# Altium project SensoMonitor.PrjPcb
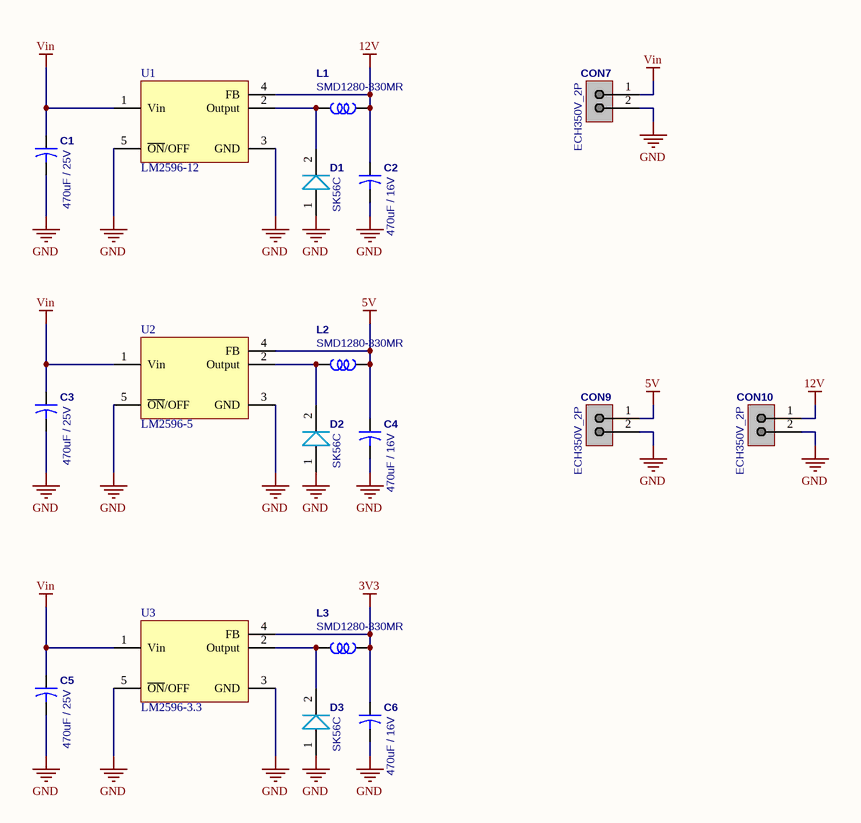
[diagram p0: Power.SchDoc]
4 sheets, 121 parts. Net scope: global (net labels, ports and power ports of the same name join across sheets).
Board file: SensoMonitor.PcbDoc
Sheets:
  Power.SchDoc
  MCU.SchDoc
  ETHERNET.SchDoc
  GPIO_COMM.SchDoc

## Sheet Power.SchDoc
size A4; SheetNumber: 1; SheetTotal: 4

### Parts
C1  470uF / 25V  [Cap470u_25V]
C2  470uF / 16V  [Cap470u_16V]
C3  470uF / 25V  [Cap470u_25V]
C4  470uF / 16V  [Cap470u_16V]
C5  470uF / 25V  [Cap470u_25V]
C6  470uF / 16V  [Cap470u_16V]
CON7  ECH350V_2P  [CON2P_ECH350V]
CON9  ECH350V_2P  [CON2P_ECH350V]
CON10  ECH350V_2P  [CON2P_ECH350V]
D1  SK56C  [DIODE_SK56C]
D2  SK56C  [DIODE_SK56C]
D3  SK56C  [DIODE_SK56C]
L1  SMD1280-330MR  [IND33uCoil]
L2  SMD1280-330MR  [IND33uCoil]
L3  SMD1280-330MR  [IND33uCoil]
U1  LM2596-12  [LM2596SX]
U2  LM2596-5  [LM2596SX]
U3  LM2596-3.3  [LM2596SX]

### Nets
3V3: C6.1 L3.1 U3.4(FB)
5V: C4.1 CON9.1 L2.1 U2.4(FB)
12V: C2.1 CON10.1 L1.1 U1.4(FB)
GND: C1.2 C2.2 C3.2 C4.2 C5.2 C6.2 CON7.2 CON9.2 CON10.2 D1.1 D2.1 D3.1 U1.3(GND) U1.5(~{ON}/OFF) U2.3(GND) U2.5(~{ON}/OFF) U3.3(GND) U3.5(~{ON}/OFF)
Vin: C1.1 C3.1 C5.1 CON7.1 U1.1(Vin) U2.1(Vin) U3.1(Vin)
NetD1_2: D1.2 L1.2 U1.2(Output)
NetD2_2: D2.2 L2.2 U2.2(Output)
NetD3_2: D3.2 L3.2 U3.2(Output)

### Library data of the parts
C1 C3 C5 = Cap470u_25V: Capacitor, 470uF / 25V / 10PI / SMD, 10mm; Value: 220uF/35V SMD_D8; Published: 23-Sep-2002; PackageReference: CAPR5-4X5; Publisher: Altium Limited
C2 C4 C6 = Cap470u_16V: Capacitor, 470uF / 25V / 8PI / SMD, 8mm; Value: 220uF/35V SMD_D8; Published: 23-Sep-2002; PackageReference: CAPR5-4X5; Publisher: Altium Limited
CON7 CON9 CON10 = CON2P_ECH350V: Connector, Terminal block 2p_ECH350V
D1-D3 = DIODE_SK56C: Schottky Barrier Rectifier SK56C
L1-L3 = IND33uCoil: 12.5mmX12.5mmX8.0mm smd Inductor, Hanam electornic.
U1 = LM2596-12: LM2596 SIMPLE SWITCHER® Power Converter 150-kHz  3-A Step-Down Voltage Regulator
U2 = LM2596-5: LM2596 SIMPLE SWITCHER® Power Converter 150-kHz  3-A Step-Down Voltage Regulator
U3 = LM2596-3.3: LM2596 SIMPLE SWITCHER® Power Converter 150-kHz  3-A Step-Down Voltage Regulator

## Sheet MCU.SchDoc
size A4; SheetNumber: 2; SheetTotal: 4
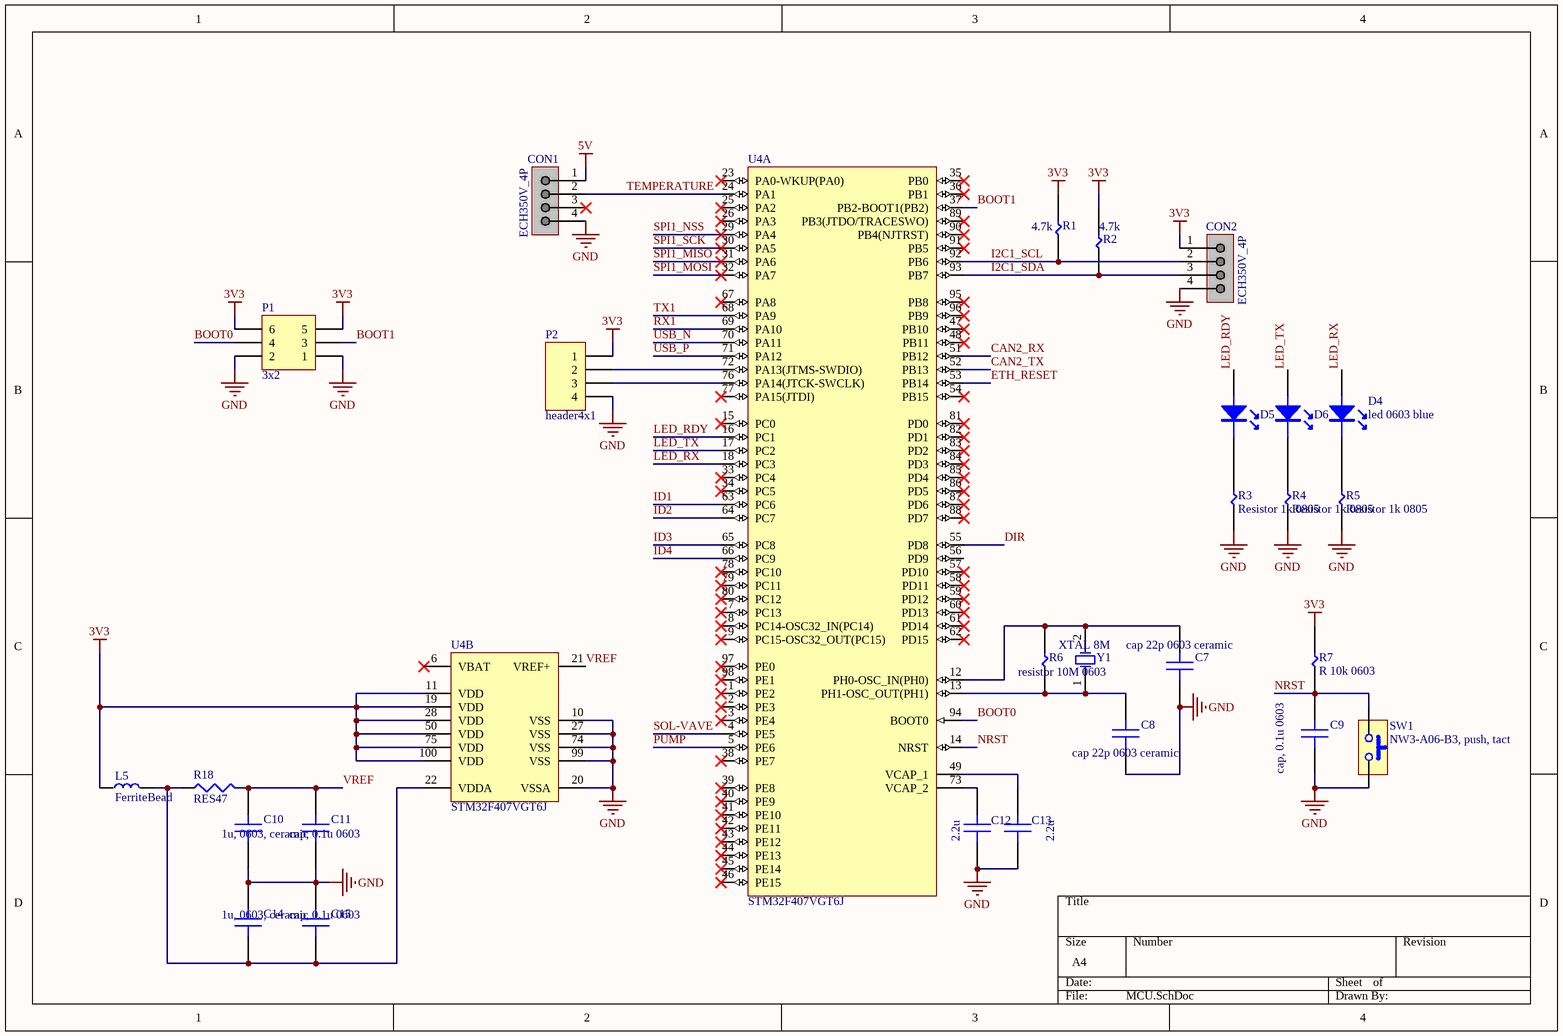
[diagram p1: MCU.SchDoc]

### Parts
C7  cap 22p 0603 ceramic  [CAP22p_0603_ceramic]
C8  cap 22p 0603 ceramic  [CAP22p_0603_ceramic]
C9  cap, 0.1u 0603  [CAP0.1u_0603_ceramic]
C10  1u, 0603, ceramic  [CAP1u_0603_ceramic]
C11  cap, 0.1u 0603  [CAP0.1u_0603_ceramic]
C12  2.2u  [CAP2.2u_0603]
C13  2.2u  [CAP2.2u_0603]
C14  1u, 0603, ceramic  [CAP1u_0603_ceramic]
C15  cap, 0.1u 0603  [CAP0.1u_0603_ceramic]
CON1  ECH350V_4P  [CON4P_ECH350V]
CON2  ECH350V_4P  [CON4P_ECH350V]
D4  led 0603 blue  [LED0603_BLUE]
D5  LED  [LED0603_GREEN]  (value not drawn)
D6  LED  [LED0603_GREEN]  (value not drawn)
L5  FerriteBead  [FerriteBD1608_102]
P1  3x2  [HDR3X2]
P2  header4x1  [HEADER4X1]
R1  4.7k  [RES4.7k_0603]
R2  4.7k  [RES4.7k_0603]
R3  Resistor 1k 0805  [RES1K_0805]
R4  Resistor 1k 0805  [RES1K_0805]
R5  Resistor 1k 0805  [RES1K_0805]
R6  resistor 10M 0603  [RES10M_0603]
R7  R 10k 0603  [RES10K_0603]
R18  RES47  [RES47_0603]
SW1  NW3-A06-B3, push, tact  [SW_TACT1]
U4  STM32F407VGT6J  [STM-LQFP100_L]  (parts A,B of 2)
Y1  XTAL 8M  [XTAL_SMD_8M]

### Nets
3V3: CON2.1 L5.1 P1.5 P1.6 P2.1 R1.2 R2.2 R7.2 U4.11(VDD) U4.19(VDD) U4.28(VDD) U4.50(VDD) U4.75(VDD) U4.100(VDD)
5V: CON1.1
GND: C7.1 C8.1 C9.1 C10.1 C11.1 C12.1 C13.1 C14.2 C15.2 CON1.4 CON2.4 P1.1 P1.2 P2.4 R3.1 R4.1 R5.1 SW1.2 U4.10(VSS) U4.20(VSSA) U4.27(VSS) U4.74(VSS) U4.99(VSS)
BOOT0: P1.4 U4.94(BOOT0)
BOOT1: P1.3 U4.37(PB2-BOOT1(PB2))
CAN2_RX: U4.51(PB12)
CAN2_TX: U4.52(PB13)
DIR: U4.55(PD8)
ETH_RESET: U4.53(PB14)
I2C1_SCL: CON2.2 R1.1 U4.92(PB6)
I2C1_SDA: CON2.3 R2.1 U4.93(PB7)
ID1: U4.63(PC6)
ID2: U4.64(PC7)
ID3: U4.65(PC8)
ID4: U4.66(PC9)
LED_RDY: D5.A U4.16(PC1)
LED_RX: D4.A U4.18(PC3)
LED_TX: D6.A U4.17(PC2)
NRST: C9.2 R7.1 SW1.1 U4.14(NRST)
PUMP: U4.5(PE6)
RX1: U4.69(PA10)
SOL-VAVE: U4.4(PE5)
SPI1_MISO: U4.31(PA6)
SPI1_MOSI: U4.32(PA7)
SPI1_NSS: U4.29(PA4)
SPI1_SCK: U4.30(PA5)
TEMPERATURE: CON1.2 U4.24(PA1)
TX1: U4.68(PA9)
USB_N: U4.70(PA11)
USB_P: U4.71(PA12)
VREF: C10.2 C11.2 R18.2 U4.21(VREF+)
NetC7_2: C7.2 R6.2 U4.12(PH0-OSC_IN(PH0)) Y1.2(OSC2)
NetC8_2: C8.2 R6.1 U4.13(PH1-OSC_OUT(PH1)) Y1.1(OSC1)
NetC12_2: C12.2 U4.73(VCAP_2)
NetC13_2: C13.2 U4.49(VCAP_1)
NetC14_1: C14.1 C15.1 L5.2 R18.1 U4.22(VDDA)
NetD4_K: D4.K R5.2
NetD5_K: D5.K R3.2
NetD6_K: D6.K R4.2
NetP2_2: P2.2 U4.72(PA13(JTMS-SWDIO))
NetP2_3: P2.3 U4.76(PA14(JTCK-SWCLK))

Not connected (* = marked no-connect by the designer): CON1 3(150)*; U4 1(PE2)* 2(PE3)* 3(PE4)* 6(VBAT)* 7(PC13)* 8(PC14-OSC32_IN(PC14))* 9(PC15-OSC32_OUT(PC15))* 15(PC0)* 23(PA0-WKUP(PA0))* 25(PA2)* 26(PA3)* 33(PC4)* 34(PC5)* 35(PB0)* 36(PB1)* 38(PE7)* 39(PE8)* 40(PE9)* 41(PE10)* 42(PE11)* 43(PE12)* 44(PE13)* 45(PE14)* 46(PE15)* 47(PB10)* 48(PB11)* 54(PB15)* 56(PD9) 57(PD10)* 58(PD11)* 59(PD12)* 60(PD13)* 61(PD14)* 62(PD15)* 67(PA8)* 77(PA15(JTDI))* 78(PC10)* 79(PC11)* 80(PC12)* 81(PD0)* 82(PD1)* 83(PD2)* 84(PD3)* 85(PD4)* 86(PD5)* 87(PD6)* 88(PD7)* 89(PB3(JTDO/TRACESWO))* 90(PB4(NJTRST))* 91(PB5)* 95(PB8)* 96(PB9)* 97(PE0)* 98(PE1)*

### Library data of the parts
C7 C8 = CAP22p_0603_ceramic
C9 C11 C15 = CAP0.1u_0603_ceramic
C10 C14 = CAP1u_0603_ceramic
C12 C13 = CAP2.2u_0603
CON1 CON2 = CON4P_ECH350V: Connector, Terminal block 4p_ECH350V
D4 = LED0603_BLUE
D5 D6 = LED0603_GREEN
L5 = FerriteBD1608_102: FCM1608KF-102T02, 200mA 1 700mΩ 1kΩ@100MHz ±25% 0603 Ferrite Beads ROHS; Manufacturer: Tai Tech; Supplier 1: Digikey; Manufacturer Part Number: FCM1608KF-102T02; RoHS: No; Category: Ferrite Beads and Chips; Stock 1: 15000; Pricing 1: 1=0.1, 10=0.025, 25=0.0224, 50=0.0202, 100=0.0182, 250=0.01332, 500=0.0097, 1000=0.00949 (USD); Supplier Part Number 1: 4816-FCM1608KF-102T02CT-ND
P1 = HEADER3X2: header 3x2
R1 R2 = RES4.7k_0603
R3-R5 = RES1K_0805
R6 = RES10M_0603
R7 = RES10K_0603
R18 = RES47_0603
SW1 = SW_TACT1: NW3-A06-B3
U4 = CMP-0243-00034-2: ARM Cortex-M4 32-bit MCU+FPU, 210 DMIPS, 1024 kB Flash, 192 kB Internal RAM, 82 I/Os, 100-pin LQFP, -40 to 85 degC, Tray; Manufacturer: STMicroelectronics; Internal RAM Size (kB): 192; Operating Frequency(F) (Processor speed) (MHz): 168; FLASH Size (Prog) (kB): 1024; I/Os (High Current): 82; Supply Voltage(Vcc) max (V): 3.6; D/A Converter: 2x12-bit; Supply Voltage(Vcc) min (V): 1.8; PackageReference: LQFP100; ComponentLink2URL: http://www.st.com/st-web-ui/static/active/en/resource/technical/document/datasheet/DM00037051.pdf; Packing: Tray; ComponentLink3Description: Package Specification; PackageDescription: 100-Pin Low Profile Quad Flat Package, 14 x 14 mm Body, 0.5 mm Pitch; PackageVersion: Rev. 1, 06/2013; ComponentLink1Description: Manufacturer URL; PartNumber: STM32F407VGT6J; Core: ARM Cortex-M4; ComponentLink2Description: Datasheet; ComponentLink1URL: http://www.st.com/web/en/home.html; Mounting Technology: Surface Mount; DatasheetVersion: Rev. 4; ComponentLink3URL: http://www.st.com/st-web-ui/static/active/en/resource/technical/document/data_brief/DM00071938.pdf
Y1 = XTAL8M

## Sheet ETHERNET.SchDoc
size A4; SheetNumber: 3; SheetTotal: 4
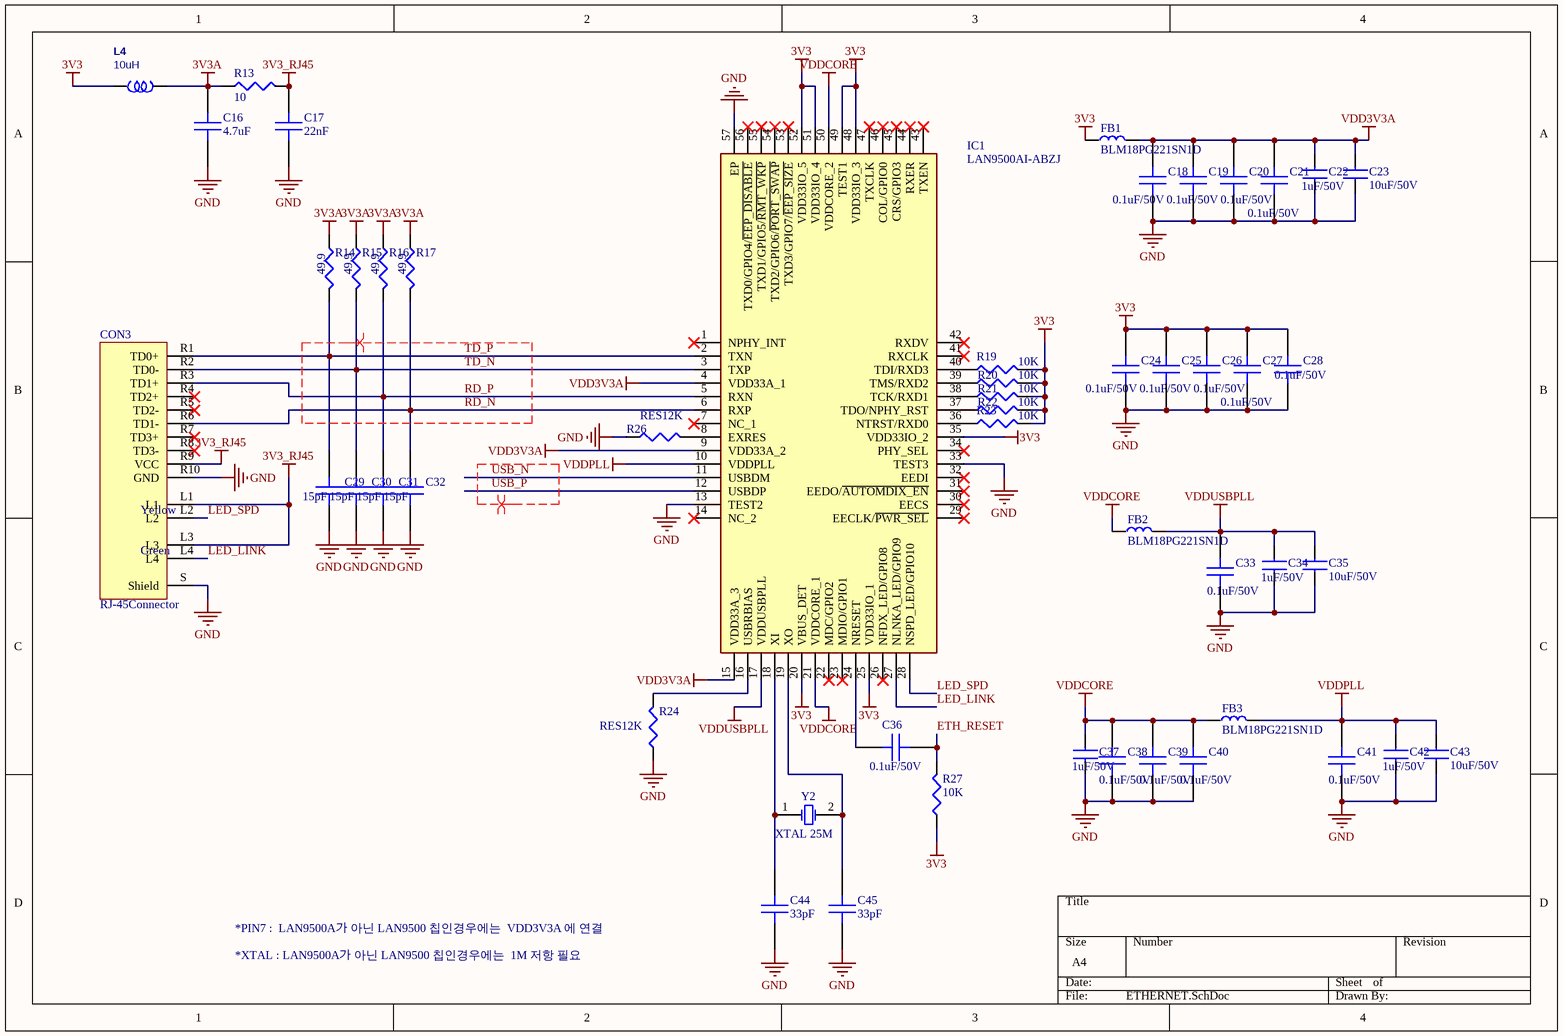
[diagram p2: ETHERNET.SchDoc]

### Parts
C16  4.7uF  [CAP2.2u_0603]
C17  22nF  [CAP2.2u_0603]
C18  0.1uF/50V  [CAP0.1u_0603_ceramic]
C19  0.1uF/50V  [CAP0.1u_0603_ceramic]
C20  0.1uF/50V  [CAP0.1u_0603_ceramic]
C21  0.1uF/50V  [CAP0.1u_0603_ceramic]
C22  1uF/50V  [C-2012]
C23  10uF/50V  [C-2012]
C24  0.1uF/50V  [CAP0.1u_0603_ceramic]
C25  0.1uF/50V  [CAP0.1u_0603_ceramic]
C26  0.1uF/50V  [CAP0.1u_0603_ceramic]
C27  0.1uF/50V  [CAP0.1u_0603_ceramic]
C28  0.1uF/50V  [CAP0.1u_0603_ceramic]
C29  15pF  [CAP2.2u_0603]
C30  15pF  [CAP2.2u_0603]
C31  15pF  [CAP2.2u_0603]
C32  15pF  [CAP2.2u_0603]
C33  0.1uF/50V  [CAP0.1u_0603_ceramic]
C34  1uF/50V  [C-2012]
C35  10uF/50V  [C-2012]
C36  0.1uF/50V  [CAP0.1u_0603_ceramic]
C37  1uF/50V  [C-2012]
C38  0.1uF/50V  [CAP0.1u_0603_ceramic]
C39  0.1uF/50V  [CAP0.1u_0603_ceramic]
C40  0.1uF/50V  [CAP0.1u_0603_ceramic]
C41  0.1uF/50V  [CAP0.1u_0603_ceramic]
C42  1uF/50V  [C-2012]
C43  10uF/50V  [C-2012]
C44  33pF  [CAP33p_0603]
C45  33pF  [CAP33p_0603]
CON3  RJ-45Connector  [[RJ45]24G-1835GYD2NL]
FB1  BLM18PG221SN1D  [BLM18PG221SN1D]
FB2  BLM18PG221SN1D  [BLM18PG221SN1D]
FB3  BLM18PG221SN1D  [BLM18PG221SN1D]
IC1  LAN9500AI-ABZJ  [LAN9500AI-ABZJ]
L4  10uH  [IND10uCoil]
R13  10  [RES20K_0603]
R14  49.9  [RES20K_0603]
R15  49.9  [RES20K_0603]
R16  49.9  [RES20K_0603]
R17  49.9  [RES20K_0603]
R19  10K  [RES20K_0603]
R20  10K  [RES20K_0603]
R21  10K  [RES20K_0603]
R22  10K  [RES20K_0603]
R23  10K  [RES20K_0603]
R24  RES12K  [RES20K_0603]
R26  RES12K  [RES20K_0603]
R27  10K  [RES20K_0603]
Y2  XTAL 25M  [XTAL_SMD_8M]

### Nets
3V3: C24.2 C25.2 C26.2 C27.2 C28.2 FB1.1 IC1.20(VBUS_DET) IC1.25(VDD33IO_1) IC1.35(VDD33IO_2) IC1.48(VDD33IO_3) IC1.49(TEST1) IC1.51(VDD33IO_4) IC1.52(VDD33IO_5) L4.2 R19.2 R20.2 R21.2 R22.2 R23.2 R27.1
3V3_RJ45: C17.2 CON3.L1 CON3.L3 CON3.R9(VCC) R13.2
3V3A: C16.2 L4.1 R13.1 R14.1 R15.1 R16.1 R17.1
GND: C16.1 C17.1 C18.1 C19.1 C20.1 C21.1 C22.2 C23.2 C24.1 C25.1 C26.1 C27.1 C28.1 C29.1 C30.1 C31.1 C32.1 C33.1 C34.2 C35.2 C37.2 C38.1 C39.1 C40.1 C41.1 C42.2 C43.2 C44.1 C45.1 CON3.R10(GND) CON3.S(Shield) IC1.13(TEST2) IC1.33(TEST3) IC1.57(EP) R24.1 R26.1
VDD3V3A: C18.2 C19.2 C20.2 C21.2 C22.1 C23.1 FB1.2 IC1.4(VDD33A_1) IC1.9(VDD33A_2) IC1.15(VDD33A_3)
VDDCORE: C37.1 C38.2 C39.2 C40.2 FB2.1 FB3.1 IC1.21(VDDCORE_1) IC1.50(VDDCORE_2)
VDDPLL: C41.2 C42.1 C43.1 FB3.2 IC1.10(VDDPLL)
VDDUSBPLL: C33.2 C34.1 C35.1 FB2.2 IC1.17(VDDUSBPLL)
ETH_RESET: C36.1 R27.2
LED_LINK: CON3.L4 IC1.27(NLNKA_LED/GPIO9)
LED_SPD: CON3.L2 IC1.28(NSPD_LED/GPIO10)
RD_N: C32.2 CON3.R6(TD1-) IC1.6(RXP) R17.2
RD_P: C31.2 CON3.R3(TD1+) IC1.5(RXN) R16.2
TD_N: C30.2 CON3.R2(TD0-) IC1.3(TXP) R15.2
TD_P: C29.2 CON3.R1(TD0+) IC1.2(TXN) R14.2
USB_N: IC1.11(USBDM)
USB_P: IC1.12(USBDP)
NetC36_2: C36.2 IC1.24(NRESET)
NetC44_2: C44.2 IC1.18(XI) Y2.1(OSC1)
NetC45_2: C45.2 IC1.19(XO) Y2.2(OSC2)
NetIC1_8: IC1.8(EXRES) R26.2
NetIC1_16: IC1.16(USBRBIAS) R24.2
NetIC1_36: IC1.36(NTRST/RXD0) R23.1
NetIC1_37: IC1.37(TDO/NPHY_RST) R22.1
NetIC1_38: IC1.38(TCK/RXD1) R21.1
NetIC1_39: IC1.39(TMS/RXD2) R20.1
NetIC1_40: IC1.40(TDI/RXD3) R19.1

Not connected (* = marked no-connect by the designer): CON3 R4(TD2+)* R5(TD2-)* R7(TD3+)* R8(TD3-)*; IC1 1(NPHY_INT)* 7(NC_1)* 14(NC_2)* 22(MDC/GPIO2)* 23(MDIO/GPIO1)* 26(NFDX_LED/GPIO8)* 29(EECLK/~{PWR_SEL})* 30(EECS)* 31(EEDO/~{AUTOMDIX_EN})* 32(EEDI)* 34(PHY_SEL)* 41(RXCLK)* 42(RXDV)* 43(TXEN)* 44(RXER)* 45(CRS/GPIO3)* 46(COL/GPIO0)* 47(TXCLK)* 53(TXD3/GPIO7/~{EEP_SIZE})* 54(TXD2/GPIO6/~{PORT_SWAP})* 55(TXD1/GPIO5/~{RMT_WKP})* 56(TXD0/GPIO4/~{EEP_DISABLE})*

### Layout directives
differential pair: USB_N, USB_P
differential pair; differential pair class ETH; net class ETH_IO: RD_N, RD_P, TD_N, TD_P

### Notes on the sheet
- *XTAL : LAN9500A가 아닌 LAN9500 칩인경우에는  1M 저항 필요
- *PIN7 :  LAN9500A가 아닌 LAN9500 칩인경우에는  VDD3V3A 에 연결
- (in symbol [RJ45]24G-1835GYD2NL) Yellow; Green

### Library data of the parts
C16 = CAP2.2u_0603: CAP4.7u_0603
C17 = CAP2.2u_0603: CAP22n_0603
C18-C21 C24-C28 C33 C36 C38-C41 = CAP0.1u_0603_ceramic: cap, 0.1u 0603, 50V
C22 C34 C37 C42 = Cap1_1: Capacitor, ceramic, 50V, 0805
C23 C35 C43 = Cap1_1: Capacitor, ceramic, 50V, 1206
C29-C32 = CAP2.2u_0603: CAP15pF_0603
C44 C45 = CAP33p_0603: CAP33p_0603,ceramic
CON3 = [RJ45]24G-1835GYD2NL: [RJ-45] 24G-1835GYD2NL
FB1-FB3 = BLM18PG221SN1D: Ferrite Bead, BLM18PG221SN1D, 0603; Manufacturer_Name: Murata Electronics; Datasheet Link: http://www.murata.com/~/media/webrenewal/support/library/catalog/products/emc/emifil/c31e.ashx?la=en-gb; Height: 0.95mm; Manufacturer_Part_Number: BLM18PG221SN1D; Mouser Part Number: 81-BLM18PG221SN1D; Mouser Price/Stock: https://www.mouser.co.uk/ProductDetail/Murata-Electronics/BLM18PG221SN1D?qs=uSeJpk%2F8In3JS43lpC2ejg%3D%3D; Arrow Part Number: BLM18PG221SN1D; Arrow Price/Stock: https://www.arrow.com/en/products/blm18pg221sn1d/murata-manufacturing?region=europe
IC1 = LAN9500AI-ABZJ: Integrated Circuit, LAN9500AI-ABZJ, Microchip; Datasheet Link: https://componentsearchengine.com/Datasheets/1/LAN9500AI-ABZJ.pdf; Height: 1mm; Manufacturer_Name: Microchip; Manufacturer_Part_Number: LAN9500AI-ABZJ; Mouser Part Number: 886-LAN9500AI-ABZJ; Mouser Price/Stock: https://www.mouser.co.uk/ProductDetail/Microchip-Technology/LAN9500AI-ABZJ?qs=pA5MXup5wxF%2F3MeNLOF5Rg%3D%3D; Arrow Part Number: LAN9500AI-ABZJ; Arrow Price/Stock: https://www.arrow.com/en/products/lan9500ai-abzj/microchip-technology?region=europe
L4 = IND10uCoil: 10uH(2012)
R13 = RES20K: RES10_0603
R14-R17 = RES20K: RES49.9_0603
R19-R23 R27 = RES20K: RES10K_0603
R24 R26 = RES20K: RES12K_0603,1%
Y2 = XTAL8M

## Sheet GPIO_COMM.SchDoc
size A4; SheetNumber: 4; SheetTotal: 4
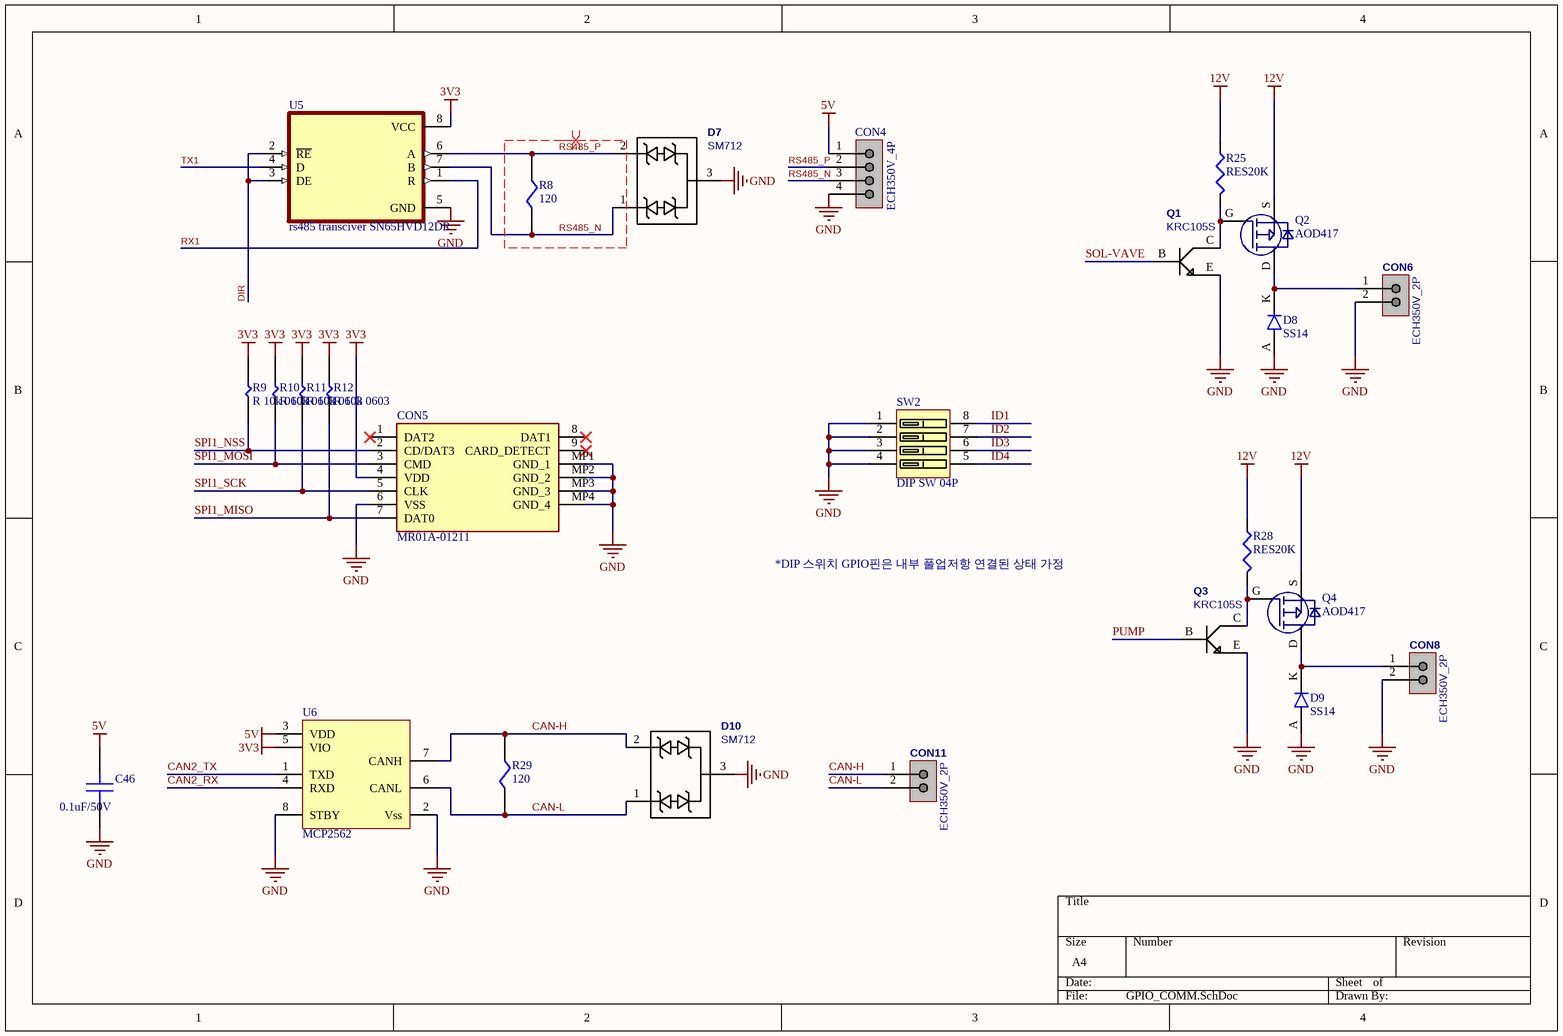
[diagram p3: GPIO_COMM.SchDoc]

### Parts
C46  0.1uF/50V  [CAP0.1u_0603_ceramic]
CON4  ECH350V_4P  [CON4P_ECH350V]
CON5  MR01A-01211  [MR01A-01211]
CON6  ECH350V_2P  [CON2P_ECH350V]
CON8  ECH350V_2P  [CON2P_ECH350V]
CON11  ECH350V_2P  [CON2P_ECH350V]
D7  SM712  [SM712]
D8  SS14  [DO-214AC]
D9  SS14  [DO-214AC]
D10  SM712  [SM712]
Q1  KRC105S  [NPN_KRC105S]
Q2  AOD417  [P-MOSFET_AOD417]
Q3  KRC105S  [NPN_KRC105S]
Q4  AOD417  [P-MOSFET_AOD417]
R8  120  [RES120_0805]
R9  R 10k 0603  [RES10K_0603]
R10  R 10k 0603  [RES10K_0603]
R11  R 10k 0603  [RES10K_0603]
R12  R 10k 0603  [RES10K_0603]
R25  RES20K  [RES20K_0603]
R28  RES20K  [RES20K_0603]
R29  120  [RES120_0805]
SW2  DIP SW 04P  [DIP SW 04P SMD (KHS42)]
U5  rs485 transciver SN65HVD12DR  [RS485_Transciver_SN65HVD12DR]
U6  MCP2562  [[CAN]MCP2562]

### Nets
3V3: CON5.4(VDD) R9.2 R10.2 R11.2 R12.2 U5.8(VCC) U6.5(VIO)
5V: C46.2 CON4.1 U6.3(VDD)
12V: Q2.S Q4.S R25.1 R28.1
GND: C46.1 CON4.4 CON5.6(VSS) CON5.MP1(GND_1) CON5.MP2(GND_2) CON5.MP3(GND_3) CON5.MP4(GND_4) CON6.2 CON8.2 D7.3 D8.A D9.A D10.3 Q1.E Q3.E SW2.1 SW2.2 SW2.3 SW2.4 U5.5(GND) U6.2(Vss) U6.8(STBY)
CAN2_RX: U6.4(RXD)
CAN2_TX: U6.1(TXD)
CAN-H: CON11.1 D10.2 R29.2 U6.7(CANH)
CAN-L: CON11.2 D10.1 R29.1 U6.6(CANL)
DIR: U5.2(~{RE}) U5.3(DE)
ID1: SW2.8
ID2: SW2.7
ID3: SW2.6
ID4: SW2.5
PUMP: Q3.B
RS485_N: CON4.3 D7.1 R8.1 U5.7(B)
RS485_P: CON4.2 D7.2 R8.2 U5.6(A)
RX1: U5.1(R)
SOL-VAVE: Q1.B
SPI1_MISO: CON5.7(DAT0) R12.1
SPI1_MOSI: CON5.3(CMD) R10.1
SPI1_NSS: CON5.2(CD/DAT3) R9.1
SPI1_SCK: CON5.5(CLK) R11.1
TX1: U5.4(D)
NetCON6_1: CON6.1 D8.K Q2.D
NetCON8_1: CON8.1 D9.K Q4.D
NetQ1_C: Q1.C Q2.G R25.2
NetQ3_C: Q3.C Q4.G R28.2

Not connected (* = marked no-connect by the designer): CON5 1(DAT2)* 8(DAT1)* 9(CARD_DETECT)*

### Layout directives
differential pair: RS485_N, RS485_P

### Notes on the sheet
- *DIP 스위치 GPIO핀은 내부 풀업저항 연결된 상태 가정

### Library data of the parts
C46 = CAP0.1u_0603_ceramic: cap, 0.1u 0603, 50V
CON4 = CON4P_ECH350V: Connector, Terminal block 4p_ECH350V
CON5 = MR01A-01211: MicroSD Card Connector
CON6 CON8 CON11 = CON2P_ECH350V: Header box, Header2x1_ECH350V
D7 D10 = SM712: SM712 Series 600W Asymmetrical TVS Diode Array
D8 D9 = SS14: Schottky Barrier Rectifiers
Q1 Q3 = NPN_KRC105S
Q2 Q4 = P-MOSFET_AOD417
R8 R29 = RES120_0805
R9-R12 = RES10K_0603
R25 R28 = RES20K: RES20K_0603
SW2 = DIP SW 04P: Switch
U5 = RS485_Transciver_SN65HVD12DR
U6 = [CAN]MCP2562: CAN Transceiver, SOIC127P600X175-8N, MCP2562-E/SN

## Nets that join several sheets
3V3: Power (C6.1 L3.1 U3.4), MCU (14 pins), ETHERNET (20 pins), GPIO_COMM (7 pins)
5V: Power (C4.1 CON9.1 L2.1 U2.4), MCU (CON1.1), GPIO_COMM (C46.2 CON4.1 U6.3)
12V: Power (C2.1 CON10.1 L1.1 U1.4), GPIO_COMM (Q2.S Q4.S R25.1 R28.1)
GND: Power (18 pins), MCU (23 pins), ETHERNET (36 pins), GPIO_COMM (22 pins)
CAN2_RX: MCU (U4.51), GPIO_COMM (U6.4)
CAN2_TX: MCU (U4.52), GPIO_COMM (U6.1)
DIR: MCU (U4.55), GPIO_COMM (U5.2 U5.3)
ETH_RESET: MCU (U4.53), ETHERNET (C36.1 R27.2)
ID1: MCU (U4.63), GPIO_COMM (SW2.8)
ID2: MCU (U4.64), GPIO_COMM (SW2.7)
ID3: MCU (U4.65), GPIO_COMM (SW2.6)
ID4: MCU (U4.66), GPIO_COMM (SW2.5)
PUMP: MCU (U4.5), GPIO_COMM (Q3.B)
RX1: MCU (U4.69), GPIO_COMM (U5.1)
SOL-VAVE: MCU (U4.4), GPIO_COMM (Q1.B)
SPI1_MISO: MCU (U4.31), GPIO_COMM (CON5.7 R12.1)
SPI1_MOSI: MCU (U4.32), GPIO_COMM (CON5.3 R10.1)
SPI1_NSS: MCU (U4.29), GPIO_COMM (CON5.2 R9.1)
SPI1_SCK: MCU (U4.30), GPIO_COMM (CON5.5 R11.1)
TX1: MCU (U4.68), GPIO_COMM (U5.4)
USB_N: MCU (U4.70), ETHERNET (IC1.11)
USB_P: MCU (U4.71), ETHERNET (IC1.12)